# Altium schematic sheet vga_ps2.SchDoc
size A4
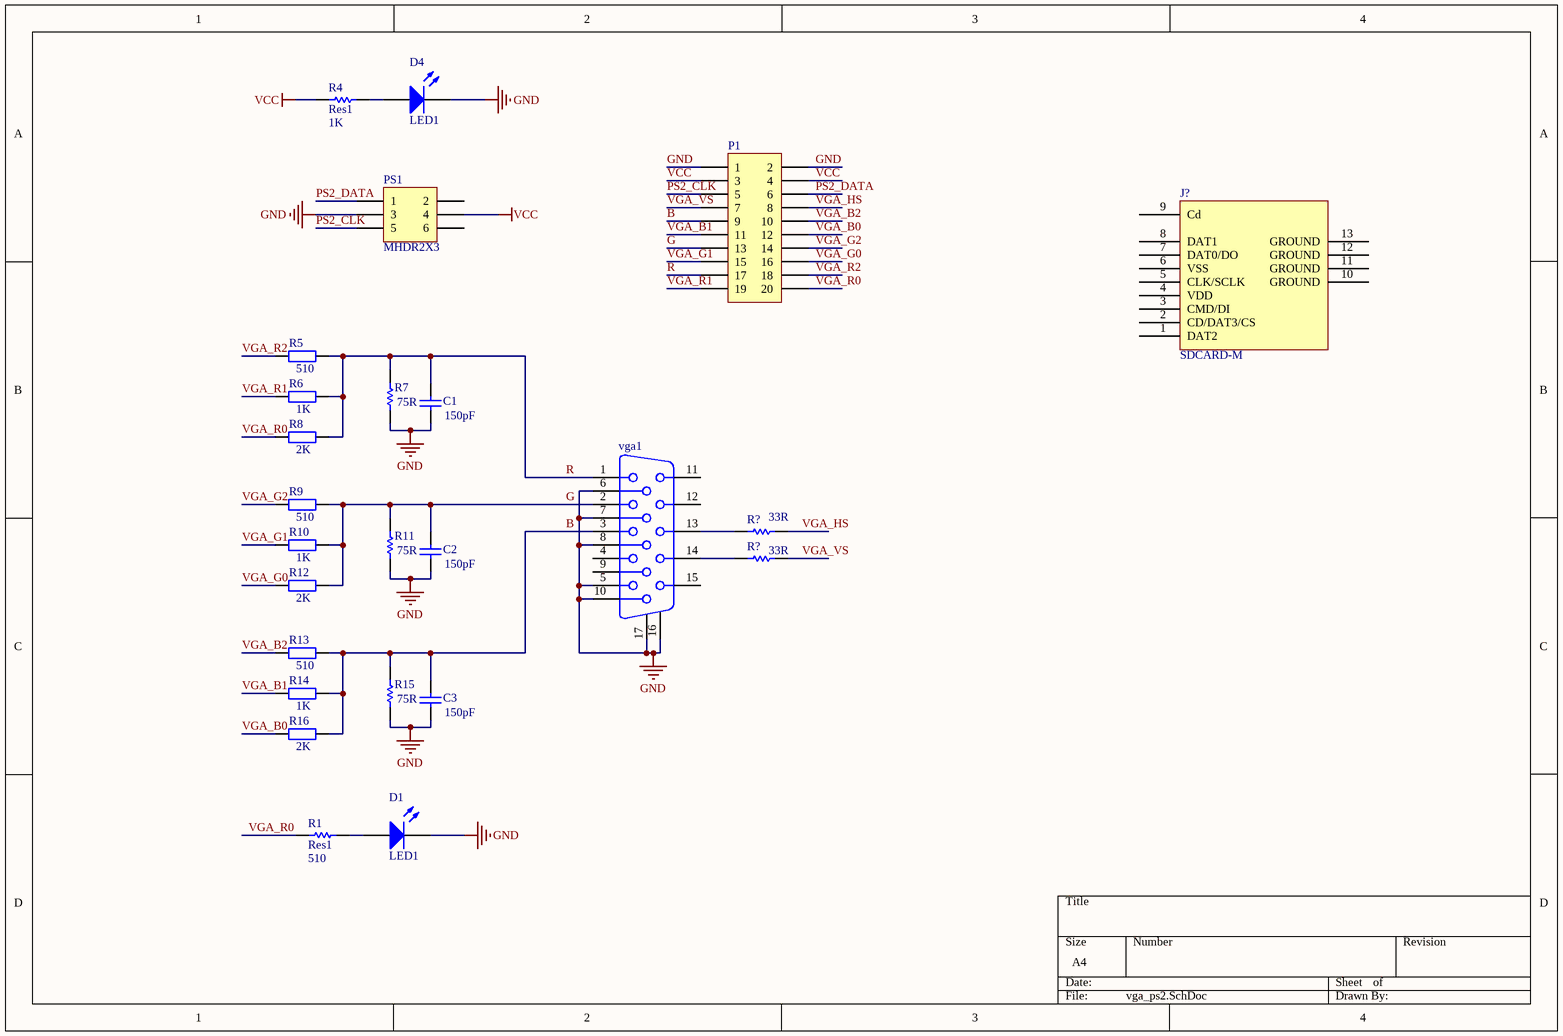
[diagram p0: vga_ps2.SchDoc]

## Parts
(Parts that share a designator on the sheet are numbered #1, #2 ... from top to bottom, then left to right.)
C1  value 150pF  [C-0805]  (hidden comment: Cap)
C2  value 150pF  [C-0805]  (hidden comment: Cap)
C3  value 150pF  [C-0805]  (hidden comment: Cap)
D1  LED1  [LED_0805]
D4  LED1  [LED_0805]
J?  SDCARD-M  [SDCARD-M]
P1  MHDR2X10  [HDR2X10]  (value not drawn)
PS1  MHDR2X3  [PS2-6PIN]
R1  Res1  value 510  [0805]
R4  Res1  value 1K  [0805]
R5  value 510  [0805]  (hidden comment: Res2)
R6  value 1K  [0805]  (hidden comment: Res2)
R7  value 75R  [0805]  (hidden comment: Res1)
R8  value 2K  [0805]  (hidden comment: Res2)
R9  value 510  [0805]  (hidden comment: Res2)
R10  value 1K  [0805]  (hidden comment: Res2)
R11  value 75R  [0805]  (hidden comment: Res1)
R12  value 2K  [0805]  (hidden comment: Res2)
R13  value 510  [0805]  (hidden comment: Res2)
R14  value 1K  [0805]  (hidden comment: Res2)
R15  value 75R  [0805]  (hidden comment: Res1)
R16  value 2K  [0805]  (hidden comment: Res2)
R?#1  value 33R  [AXIAL-0.3]  (hidden comment: Res1)
R?#2  value 33R  [AXIAL-0.3]  (hidden comment: Res1)
vga1  D Connector 15  [DB15-F]  (value not drawn)

## Nets
GND: C1.1 C2.1 C3.1 D1.2(K) D4.2(K) P1.1 P1.2 PS1.3 R7.1 R11.1 R15.1 vga1.5 vga1.6 vga1.7 vga1.8 vga1.10 vga1.16(MH2) vga1.17(MH1)
VCC: P1.3 P1.4 PS1.4 R4.1
B: C3.2 P1.9 R13.2 R14.2 R15.2 R16.2 vga1.3
G: C2.2 P1.13 R9.2 R10.2 R11.2 R12.2 vga1.2
PS2_CLK: P1.5 PS1.5
PS2_DATA: P1.6 PS1.1
R: C1.2 P1.17 R5.2 R6.2 R7.2 R8.2 vga1.1
VGA_B0: P1.12 R16.1
VGA_B1: P1.11 R14.1
VGA_B2: P1.10 R13.1
VGA_G0: P1.16 R12.1
VGA_G1: P1.15 R10.1
VGA_G2: P1.14 R9.1
VGA_HS: P1.8 R?#1.2
VGA_R0: P1.20 R1.1 R8.1
VGA_R1: P1.19 R6.1
VGA_R2: P1.18 R5.1
VGA_VS: P1.7 R?#2.2
NetD1_1: D1.1(A) R1.2
NetD4_1: D4.1(A) R4.2
NetR?#1_1: R?#1.1 vga1.13
NetR?#2_1: R?#2.1 vga1.14

Not connected (* = marked no-connect by the designer): J? 1(DAT2) 2(CD/DAT3/CS) 3(CMD/DI) 4(VDD) 5(CLK/SCLK) 6(VSS) 7(DAT0/DO) 8(DAT1) 9(Cd) 10(GROUND) 11(GROUND) 12(GROUND) 13(GROUND); PS1 2 6; vga1 4 9 11 12 15

## Library data of the parts
C1-C3 = Cap: Capacitor; Published: 8-Jun-2000; LatestRevisionDate: 17-Jul-2002; LatestRevisionNote: Re-released for DXP Platform.; PackageReference: RAD-0.3; Publisher: Altium Limited; PackageDescription: Radial Cap, Thru-Hole; 2 Leads; 0.3 in Pin Spacing
D1 D4 = LED1: Typical RED GaAs LED; Published: 8-Jun-2000; LatestRevisionDate: 08-Jul-2005; LatestRevisionNote: Mech Layer 1 removed.; PackageReference: LED-1; Publisher: Altium Limited; PackageDescription: LED; 2 Leads
J? = SDCARD-M: TF卡槽
P1 = MHDR2X10: Header, 10-Pin, Dual row; LatestRevisionDate: 17-Jul-2002; LatestRevisionNote: Re-released for DXP Platform.; Publisher: Altium Limited
PS1 = MHDR2X3: Header, 3-Pin, Dual row; LatestRevisionDate: 17-Jul-2002; LatestRevisionNote: Re-released for DXP Platform.; Publisher: Altium Limited
R1 R4 R7 R11 R15 R?#1 R?#2 = Res1: Resistor; Published: 8-Jun-2000; LatestRevisionDate: 17-Jul-2002; LatestRevisionNote: Re-released for DXP Platform.; PackageReference: AXIAL-0.3; Publisher: Altium Limited; PackageDescription: Axial Device, Thru-Hole; 2 Leads; 0.3 in Pin Spacing
R5 R6 R8-R10 R12-R14 R16 = Res2: Resistor; Published: 8-Jun-2000; LatestRevisionDate: 17-Jul-2002; LatestRevisionNote: Re-released for DXP Platform.; PackageReference: AXIAL-0.4; Publisher: Altium Limited; PackageDescription: Axial Device, Thru-Hole; 2 Leads; 0.4 in Pin Spacing
vga1 = D Connector 15: VGA; PackageDocument: O; Positions: 9; Gender: Receptacle; Published: 15-Jun-2001; LatestRevisionDate: 17-Jul-2002; LatestRevisionNote: Re-released for DXP Platform.; DatasheetDocument: 1-Sep-1999; PackageReference: 788750; Publisher: Altium Limited; Orientation: Right Angle